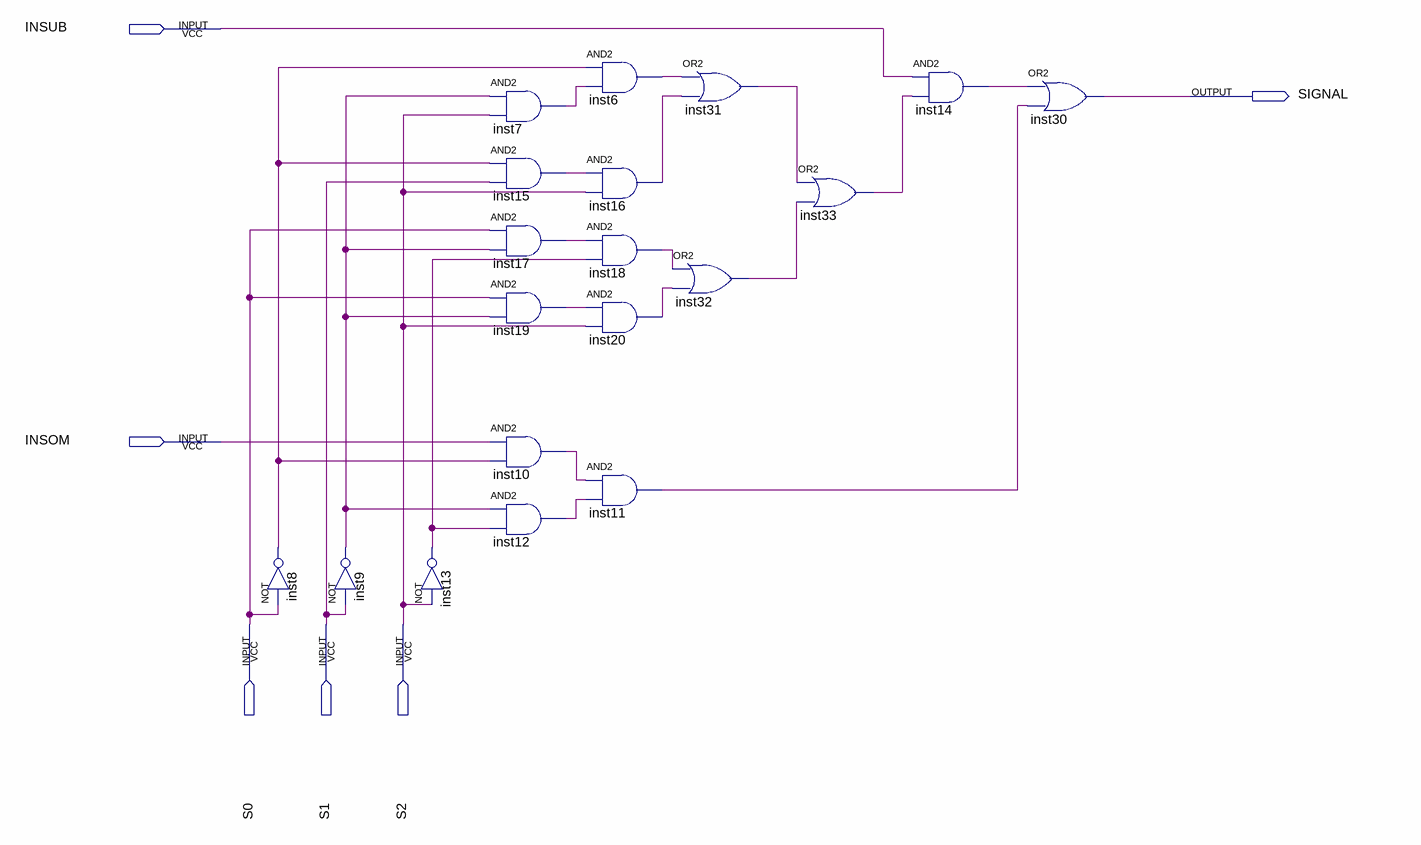
[diagram p0: schematic sheet]
// Quartus schematic sdProjectDemuxSelecSub.bdf as structural Verilog: 19 symbols, 6 pins
module sdProjectDemuxSelecSub (
  input  INSUB,
  input  INSOM,
  input  S0,
  input  S1,
  input  S2,
  output SIGNAL
);

  wire inst6_out, inst7_out, inst8_out, inst9_out, inst10_out, inst11_out, inst12_out, inst13_out,
       inst14_out, inst15_out, inst16_out, inst17_out, inst18_out, inst19_out, inst20_out, inst31_out,
       inst32_out, inst33_out;

  not inst8 (inst8_out, S0);
  not inst9 (inst9_out, S1);
  not inst13 (inst13_out, S2);
  and inst7 (inst7_out, inst9_out, S2);
  and inst15 (inst15_out, inst8_out, S1);
  and inst17 (inst17_out, S0, inst9_out);
  and inst19 (inst19_out, S0, inst9_out);
  and inst10 (inst10_out, INSOM, inst8_out);
  and inst12 (inst12_out, inst9_out, inst13_out);
  and inst6 (inst6_out, inst8_out, inst7_out);
  and inst16 (inst16_out, inst15_out, S2);
  and inst18 (inst18_out, inst17_out, inst13_out);
  and inst20 (inst20_out, inst19_out, S2);
  and inst11 (inst11_out, inst10_out, inst12_out);
  or inst31 (inst31_out, inst6_out, inst16_out);
  or inst32 (inst32_out, inst18_out, inst20_out);
  or inst33 (inst33_out, inst31_out, inst32_out);
  and inst14 (inst14_out, INSUB, inst33_out);
  or inst30 (SIGNAL, inst14_out, inst11_out);
endmodule
